# EAGLE board Mainboard (EAGLE 9.0.1), part 1 of 2
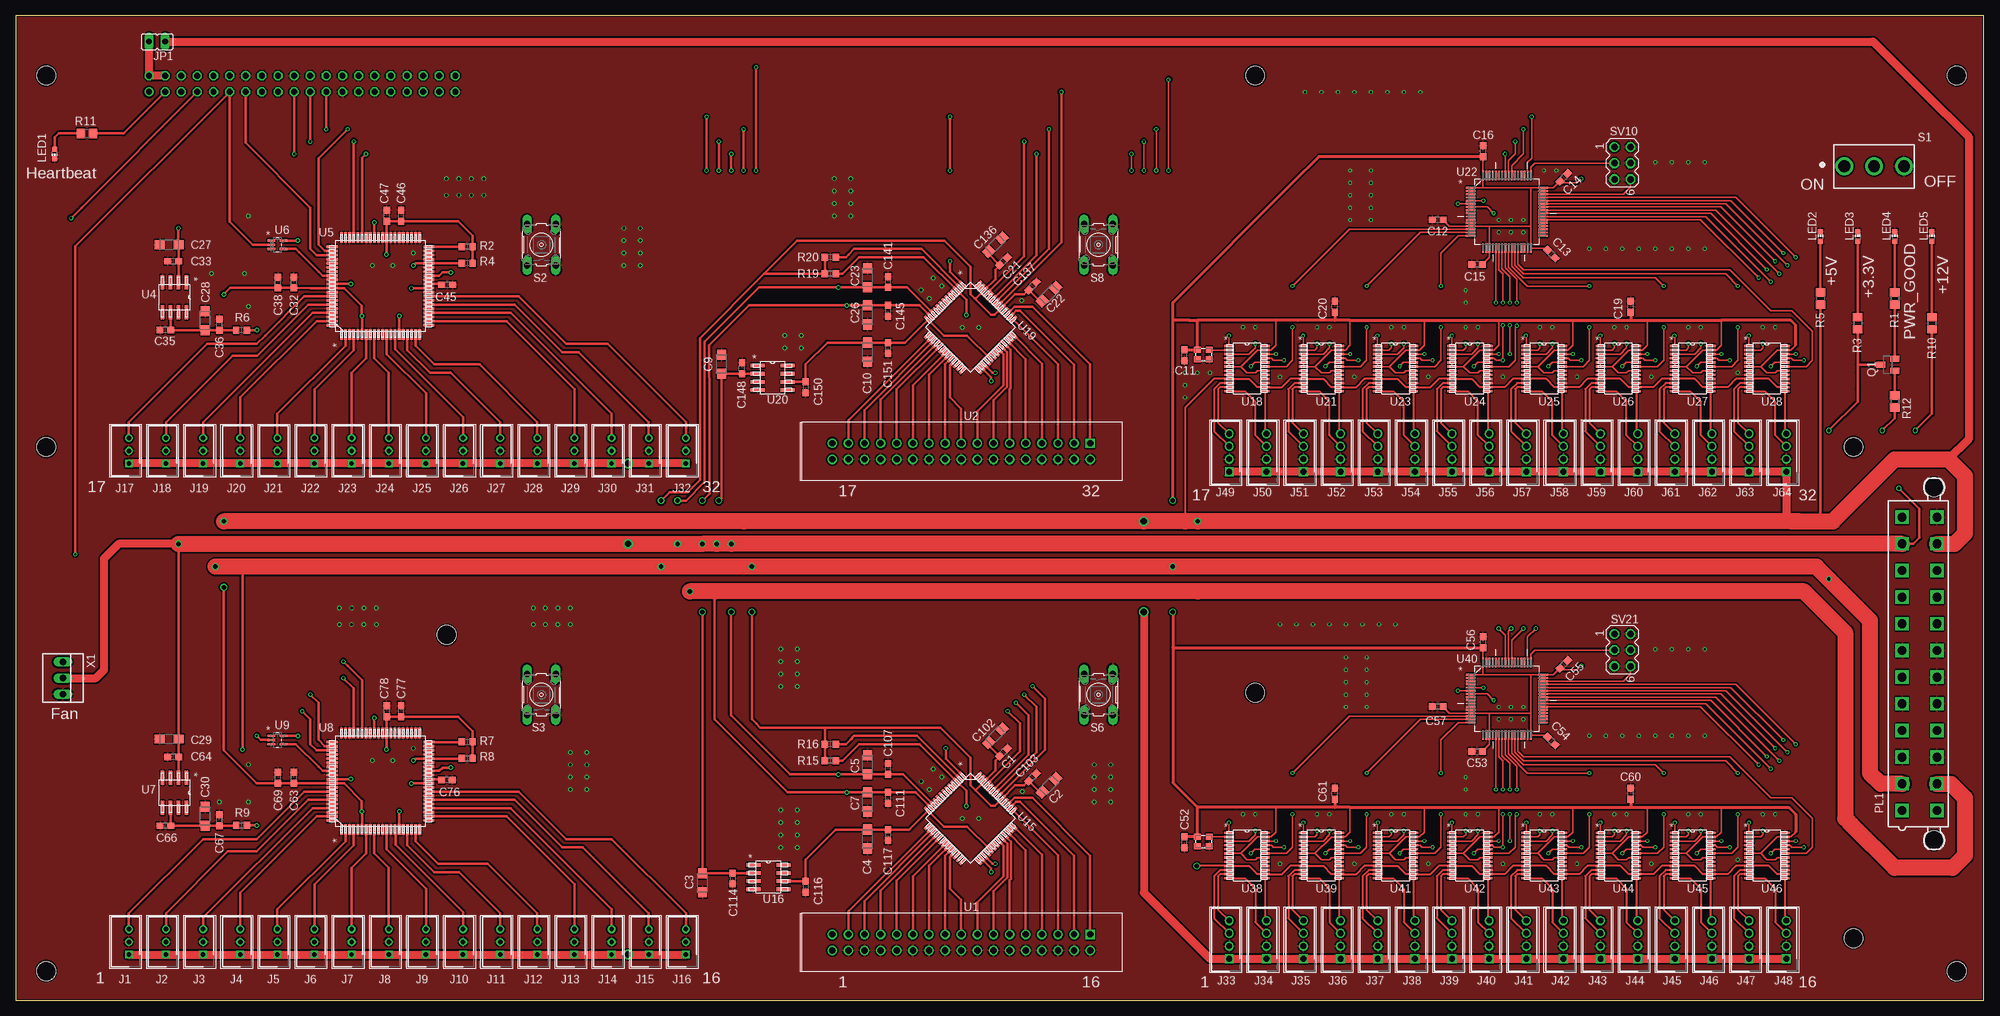
[diagram p11: board, top side]
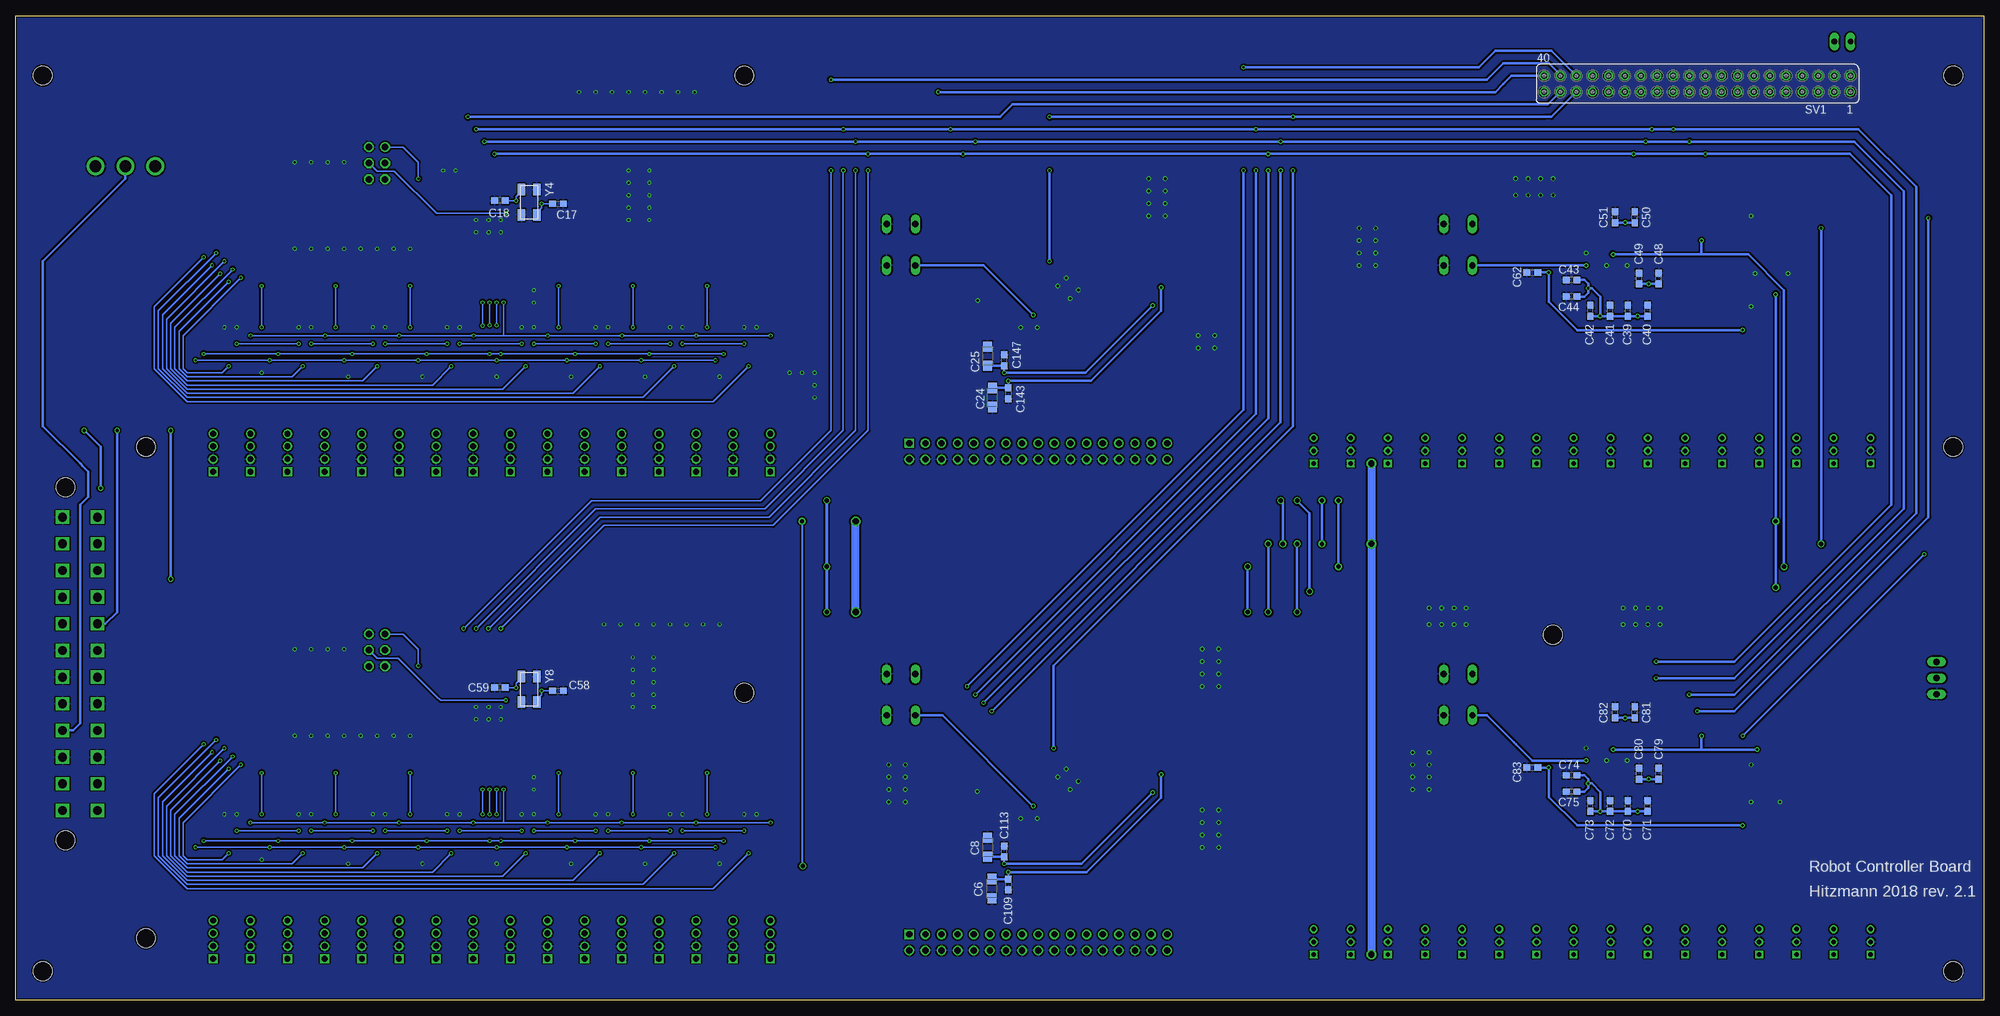
[diagram p12: board, bottom side, seen from below]

Size 310 x 155 mm. Coordinates in mm from the lower left corner, seen from the top.
Outline: 0,0 310,0 310,155 0,155 0,0
Copper layers (1*16): Top 0.035mm / dielectric 1.5mm / Bottom 0.035mm
Design rules "dirt_cheap_dirty_boards.v1.1": minimum track width 6mil, minimum drill 12mil, track to track 6mil, track to pad 6mil, pad to pad 6mil, via to via 6mil, smd to smd 0mil, copper to edge 10mil, drill to drill 10mil, minimum pad ring 10mil, minimum via ring 6mil, stop-mask expansion 2mil, vias tented up to drill 25mil, thermal gap 10mil
Holes 3 mm at 289.5,87.1 289.5,9.75 305.75,145.6 305.75,4.55 4.8,4.55 4.8,145.6 195.25,145.6 4.8,87.1 195.25,48.4 67.85,57.5

## Footprints (pad centres in the part's own frame; a part is rotated, then mirrored left to right if it is on the bottom)
SMC_A = smd 1.6 x 1.4: + -1.5,0; - 1.5,0
C0603 = smd 1.1 x 1: 1 -0.85,0; 2 0.85,0
JST_PH_SHDR3W50P0X200_1X3_790X450X600 = drill 0.7 pad 1.1 square: 1 0,0 | drill 0.7 pad 1.1: 2 2,0; 3 4,0
SHDR4W50P0X200_1X4_990X450X600 = drill 0.9 pad 1.35 square: 1 0,0 | drill 0.9 pad 1.35: 2 2,0; 3 4,0; 4 6,0
JP1 = drill 0.914 long: 1 0,-1.27; 2 0,1.27
CHIP-LED0603 = smd 0.8 x 0.8: A 0,-0.75; C 0,0.75
5566-24 = drill 1.4 square: 1 23.1,-2.75; 2 18.9,-2.75; 3 14.7,-2.75; 4 10.5,-2.75; 5 6.3,-2.75; 6 2.1,-2.75; 7 -2.1,-2.75; 8 -6.3,-2.75; 9 -10.5,-2.75; 10 -14.7,-2.75; 11 -18.9,-2.75; 12 -23.1,-2.75; 13 23.1,2.75; 14 18.9,2.75; 15 14.7,2.75; 16 10.5,2.75; 17 6.3,2.75; 18 2.1,2.75; 19 -2.1,2.75; 20 -6.3,2.75; 21 -10.5,2.75; 22 -14.7,2.75; 23 -18.9,2.75; 24 -23.1,2.75 | hole 3: 27.8,2.29; -27.8,2.29
SOT23-BEC = smd 1 x 1.4: B -0.95,-1.1; C 0,1.1; E 0.95,-1.1
R0805 = smd 1.3 x 1.5: 1 -0.95,0; 2 0.95,0
R0603 = smd 1 x 1.1: 1 -0.85,0; 2 0.85,0
1MS1T1B1M2QES-5 = drill 1.85 pad 2.8: 1 0,-4.7; 2 0,0; 3 0,4.7
B3F-10XX = drill 1.016 long: 1 -3.251,2.261; 2 3.251,2.261; 3 -3.251,-2.261; 4 3.251,-2.261
FE20-2 = drill 0.914: 1 -24.13,1.27 | drill 0.914 octagon: 2 -24.13,-1.27; 3 -21.59,1.27; 4 -21.59,-1.27; 5 -19.05,1.27; 6 -19.05,-1.27; 7 -16.51,1.27; 8 -16.51,-1.27; 9 -13.97,1.27; 10 -13.97,-1.27; 11 -11.43,1.27; 12 -11.43,-1.27; 13 -8.89,1.27; 14 -8.89,-1.27; 15 -6.35,1.27; 16 -6.35,-1.27; 17 -3.81,1.27; 18 -3.81,-1.27; 19 -1.27,1.27; 20 -1.27,-1.27; 21 1.27,1.27; 22 1.27,-1.27; 23 3.81,1.27; 24 3.81,-1.27; 25 6.35,1.27; 26 6.35,-1.27; 27 8.89,1.27; 28 8.89,-1.27; 29 11.43,1.27; 30 11.43,-1.27; 31 13.97,1.27; 32 13.97,-1.27; 33 16.51,1.27; 34 16.51,-1.27; 35 19.05,1.27; 36 19.05,-1.27; 37 21.59,1.27; 38 21.59,-1.27; 39 24.13,1.27; 40 24.13,-1.27
MA03-2 = drill 1.016: 1 -2.54,-1.27 | drill 1.016 octagon: 2 -2.54,1.27; 3 0,-1.27; 4 0,1.27; 5 2.54,-1.27; 6 2.54,1.27
AMP-5103309-7-34PIN_TYCO_5103309-7 = drill 0.965 square: 1 0,2.54 | drill 0.965: 2 0,0; 3 -2.54,2.54; 4 -2.54,0; 5 -5.08,2.54; 6 -5.08,0; 7 -7.62,2.54; 8 -7.62,0; 9 -10.16,2.54; 10 -10.16,0; 11 -12.7,2.54; 12 -12.7,0; 13 -15.24,2.54; 14 -15.24,0; 15 -17.78,2.54; 16 -17.78,0; 17 -20.32,2.54; 18 -20.32,0; 19 -22.86,2.54; 20 -22.86,0; 21 -25.4,2.54; 22 -25.4,0; 23 -27.94,2.54; 24 -27.94,0; 25 -30.48,2.54; 26 -30.48,0; 27 -33.02,2.54; 28 -33.02,0; 29 -35.56,2.54; 30 -35.56,0; 31 -38.1,2.54; 32 -38.1,0; 33 -40.64,2.54; 34 -40.64,0
R_8 = smd 2.184 x 0.559: 1 -2.362,1.905; 2 -2.362,0.635; 3 -2.362,-0.635; 4 -2.362,-1.905; 5 2.362,-1.905; 6 2.362,-0.635; 7 2.362,0.635; 8 2.362,1.905
ST_80_2 = smd 1.676 x 0.432: 1 -7.62,6.175; 2 -7.62,5.525; 3 -7.62,4.875; 4 -7.62,4.225; 5 -7.62,3.575; 6 -7.62,2.925; 7 -7.62,2.275; 8 -7.62,1.625; 9 -7.62,0.975; 10 -7.62,0.325; 11 -7.62,-0.325; 12 -7.62,-0.975; 13 -7.62,-1.625; 14 -7.62,-2.275; 15 -7.62,-2.925; 16 -7.62,-3.575; 17 -7.62,-4.225; 18 -7.62,-4.875; 19 -7.62,-5.525; 20 -7.62,-6.175; 41 7.62,-6.175; 42 7.62,-5.525; 43 7.62,-4.875; 44 7.62,-4.225; 45 7.62,-3.575; 46 7.62,-2.925; 47 7.62,-2.275; 48 7.62,-1.625; 49 7.62,-0.975; 50 7.62,-0.325; 51 7.62,0.325; 52 7.62,0.975; 53 7.62,1.625; 54 7.62,2.275; 55 7.62,2.925; 56 7.62,3.575; 57 7.62,4.225; 58 7.62,4.875; 59 7.62,5.525; 60 7.62,6.175 | smd 0.432 x 1.676: 21 -6.175,-7.62; 22 -5.525,-7.62; 23 -4.875,-7.62; 24 -4.225,-7.62; 25 -3.575,-7.62; 26 -2.925,-7.62; 27 -2.275,-7.62; 28 -1.625,-7.62; 29 -0.975,-7.62; 30 -0.325,-7.62; 31 0.325,-7.62; 32 0.975,-7.62; 33 1.625,-7.62; 34 2.275,-7.62; 35 2.925,-7.62; 36 3.575,-7.62; 37 4.225,-7.62; 38 4.875,-7.62; 39 5.525,-7.62; 40 6.175,-7.62; 61 6.175,7.62; 62 5.525,7.62; 63 4.875,7.62; 64 4.225,7.62; 65 3.575,7.62; 66 2.925,7.62; 67 2.275,7.62; 68 1.625,7.62; 69 0.975,7.62; 70 0.325,7.62; 71 -0.325,7.62; 72 -0.975,7.62; 73 -1.625,7.62; 74 -2.275,7.62; 75 -2.925,7.62; 76 -3.575,7.62; 77 -4.225,7.62; 78 -4.875,7.62; 79 -5.525,7.62; 80 -6.175,7.62
SOT65P210X110-5N = smd 1.168 x 0.356: 1 -0.965,0.66; 2 -0.965,0; 3 -0.965,-0.66; 4 0.965,-0.66; 5 0.965,0.66
ST_52 = smd 1.473 x 0.432: 1 -5.613,3.9; 2 -5.613,3.25; 3 -5.613,2.6; 4 -5.613,1.95; 5 -5.613,1.3; 6 -5.613,0.65; 7 -5.613,0; 8 -5.613,-0.65; 9 -5.613,-1.3; 10 -5.613,-1.95; 11 -5.613,-2.6; 12 -5.613,-3.25; 13 -5.613,-3.9; 27 5.613,-3.9; 28 5.613,-3.25; 29 5.613,-2.6; 30 5.613,-1.95; 31 5.613,-1.3; 32 5.613,-0.65; 33 5.613,0; 34 5.613,0.65; 35 5.613,1.3; 36 5.613,1.95; 37 5.613,2.6; 38 5.613,3.25; 39 5.613,3.9 | smd 0.432 x 1.473: 14 -3.9,-5.613; 15 -3.25,-5.613; 16 -2.6,-5.613; 17 -1.95,-5.613; 18 -1.3,-5.613; 19 -0.65,-5.613; 20 0,-5.613; 21 0.65,-5.613; 22 1.3,-5.613; 23 1.95,-5.613; 24 2.6,-5.613; 25 3.25,-5.613; 26 3.9,-5.613; 40 3.9,5.613; 41 3.25,5.613; 42 2.6,5.613; 43 1.95,5.613; 44 1.3,5.613; 45 0.65,5.613; 46 0,5.613; 47 -0.65,5.613; 48 -1.3,5.613; 49 -1.95,5.613; 50 -2.6,5.613; 51 -3.25,5.613; 52 -3.9,5.613
RU_24 = smd 1.473 x 0.356: 1 -2.819,3.575; 2 -2.819,2.925; 3 -2.819,2.275; 4 -2.819,1.625; 5 -2.819,0.975; 6 -2.819,0.325; 7 -2.819,-0.325; 8 -2.819,-0.975; 9 -2.819,-1.625; 10 -2.819,-2.275; 11 -2.819,-2.925; 12 -2.819,-3.575; 13 2.819,-3.575; 14 2.819,-2.925; 15 2.819,-2.275; 16 2.819,-1.625; 17 2.819,-0.975; 18 2.819,-0.325; 19 2.819,0.325; 20 2.819,0.975; 21 2.819,1.625; 22 2.819,2.275; 23 2.819,2.925; 24 2.819,3.575
QFP50P1200X1200X160-64N = smd 1.473 x 0.279: 1 -5.715,3.759; 2 -5.715,3.251; 3 -5.715,2.743; 4 -5.715,2.261; 5 -5.715,1.753; 6 -5.715,1.245; 7 -5.715,0.762; 8 -5.715,0.254; 9 -5.715,-0.254; 10 -5.715,-0.762; 11 -5.715,-1.245; 12 -5.715,-1.753; 13 -5.715,-2.261; 14 -5.715,-2.743; 15 -5.715,-3.251; 16 -5.715,-3.759; 33 5.715,-3.759; 34 5.715,-3.251; 35 5.715,-2.743; 36 5.715,-2.261; 37 5.715,-1.753; 38 5.715,-1.245; 39 5.715,-0.762; 40 5.715,-0.254; 41 5.715,0.254; 42 5.715,0.762; 43 5.715,1.245; 44 5.715,1.753; 45 5.715,2.261; 46 5.715,2.743; 47 5.715,3.251; 48 5.715,3.759 | smd 0.279 x 1.473: 17 -3.759,-5.715; 18 -3.251,-5.715; 19 -2.743,-5.715; 20 -2.261,-5.715; 21 -1.753,-5.715; 22 -1.245,-5.715; 23 -0.762,-5.715; 24 -0.254,-5.715; 25 0.254,-5.715; 26 0.762,-5.715; 27 1.245,-5.715; 28 1.753,-5.715; 29 2.261,-5.715; 30 2.743,-5.715; 31 3.251,-5.715; 32 3.759,-5.715; 49 3.759,5.715; 50 3.251,5.715; 51 2.743,5.715; 52 2.261,5.715; 53 1.753,5.715; 54 1.245,5.715; 55 0.762,5.715; 56 0.254,5.715; 57 -0.254,5.715; 58 -0.762,5.715; 59 -1.245,5.715; 60 -1.753,5.715; 61 -2.261,5.715; 62 -2.743,5.715; 63 -3.251,5.715; 64 -3.759,5.715
22-23-2031 = drill 1 long: 1 -2.54,0; 2 0,0; 3 2.54,0
KC2520B-C1 = smd 1.05 x 0.95: 1 0,-1.45; 2 1.85,-1.45; 3 1.85,0; 4 0,0
ABM3B = smd 1.8 x 1.2: 1 0,-2.4; 2 4,-2.4; 3 4,0; 4 0,0

## Placement (x,y rotation side)
C1  10uF  [SMC_A]  154.3,41.6 45 top
C2  10uF  [SMC_A]  162.75,33.8 45 top
C3  10uF  [SMC_A]  108.15,18.45 270 top
C4  10uF  [SMC_A]  134.15,25.35 270 top
C5  10uF  [SMC_A]  134.15,37.05 90 top
C6  10uF  [SMC_A]  156.25,17.55 270 bottom
C7  10uF  [SMC_A]  134.15,31.2 90 top
C8  10uF  [SMC_A]  156.9,24.05 270 bottom
C9  10uF  [SMC_A]  111.15,100.15 90 top
C10  10uF  [SMC_A]  134.15,102.05 270 top
C11  100nF  [C0603]  184.1,101.55 90 top
C12  100nF  [C0603]  224,122.9 0 top
C13  100nF  [C0603]  241.9,117.5 315 top
C14  100nF  [C0603]  243.85,129.55 45 top
C15  100nF  [C0603]  230.2,115.85 180 top
C16  100nF  [C0603]  231.15,133.7 90 top
C17  33pf  [C0603]  224.6,125.4 0 bottom
C18  33pf  [C0603]  233.75,125.9 180 bottom
C19  100nF  [C0603]  254.4,109.2 90 top
C20  100nF  [C0603]  207.8,109.2 90 top
C21  10uF  [SMC_A]  154.3,118.95 45 top
C22  10uF  [SMC_A]  162.75,111.15 45 top
C23  10uF  [SMC_A]  134.15,113.75 90 top
C24  10uF  [SMC_A]  156.15,94.9 270 bottom
C25  10uF  [SMC_A]  156.9,101.4 270 bottom
C26  10uF  [SMC_A]  134.15,107.9 90 top
C27  10uF  [SMC_A]  24.15,118.95 180 top
C28  10uF  [SMC_A]  29.8,107 90 top
C29  10uF  [SMC_A]  24.15,41.1 180 top
C30  10uF  [SMC_A]  29.8,28.95 90 top
C32  100nF  [C0603]  43.8,113 90 top
C33  100nF  [C0603]  24.8,116.35 180 top
C35  100nF  [C0603]  23.55,105.5 180 top
C36  100nF  [C0603]  32.05,106.35 90 top
C38  10uF  [C0603]  41.3,113 90 top
C39  100nF  [C0603]  56.05,108.55 90 bottom
C40  10uF  [C0603]  52.95,108.55 90 bottom
C41  100nF  [C0603]  58.85,108.55 90 bottom
C42  10uF  [C0603]  61.95,108.55 90 bottom
C43  100nF  [C0603]  64.9,113.4 180 bottom
C44  10uF  [C0603]  64.9,110.8 180 bottom
C45  10uF  [C0603]  67.95,112.65 180 top
C46  100nF  [C0603]  60.7,123.5 90 top
C47  10uF  [C0603]  58.45,123.5 90 top
C48  100nF  [C0603]  51.2,113.65 90 bottom
C49  10uF  [C0603]  54.3,113.65 90 bottom
C50  10uF  [C0603]  54.95,123.3 90 bottom
C51  100nF  [C0603]  58.05,123.3 90 bottom
C52  100nF  [C0603]  184.1,24.85 90 top
C53  100nF  [C0603]  230.2,39.15 0 top
C54  100nF  [C0603]  241.9,40.8 315 top
C55  100nF  [C0603]  243.85,52.85 45 top
C56  100nF  [C0603]  231.15,56.35 90 top
C57  100nF  [C0603]  224,46.2 180 top
C58  33pf  [C0603]  224.6,48.7 0 bottom
C59  33pf  [C0603]  233.75,49.2 180 bottom
C60  100nF  [C0603]  254.4,32.5 90 top
C61  100nF  [C0603]  207.8,32.5 90 top
C62  100nF  [C0603]  71.1,114.6 0 bottom
C63  100nF  [C0603]  43.8,35 90 top
C64  100nF  [C0603]  24.8,38.3 180 top
C66  100nF  [C0603]  23.55,27.45 180 top
C67  100nF  [C0603]  32.05,28.3 90 top
C69  10uF  [C0603]  41.3,35 90 top
C70  100nF  [C0603]  56.05,30.55 90 bottom
C71  10uF  [C0603]  52.95,30.55 90 bottom
C72  100nF  [C0603]  58.85,30.55 90 bottom
C73  10uF  [C0603]  61.95,30.55 90 bottom
C74  100nF  [C0603]  64.9,35.4 180 bottom
C75  10uF  [C0603]  64.9,32.8 180 bottom
C76  10uF  [C0603]  67.9,34.65 180 top
C77  100nF  [C0603]  60.7,45.5 90 top
C78  10uF  [C0603]  58.45,45.5 90 top
C79  100nF  [C0603]  51.2,35.65 90 bottom
C80  10uF  [C0603]  54.3,35.65 90 bottom
C81  10uF  [C0603]  54.95,45.3 90 bottom
C82  100nF  [C0603]  58.05,45.3 90 bottom
C83  100nF  [C0603]  71.1,36.6 0 bottom
C102  100nF  [C0603]  155.6,39 45 top
C103  100nF  [C0603]  160.15,35.1 45 top
C107  100nF  [C0603]  137.4,36.4 90 top
C109  100nF  [C0603]  153.65,18.2 270 bottom
C111  100nF  [C0603]  137.4,31.85 270 top
C113  100nF  [C0603]  154.3,23.4 90 bottom
C114  100nF  [C0603]  112.9,19.15 270 top
C116  100nF  [C0603]  124.4,17.85 270 top
C117  100nF  [C0603]  137.4,26 270 top
C136  100nF  [C0603]  155.6,116.35 45 top
C137  100nF  [C0603]  160.15,112.45 45 top
C141  100nF  [C0603]  137.4,113.1 90 top
C143  100nF  [C0603]  153.65,95.55 270 bottom
C145  100nF  [C0603]  137.4,108.55 270 top
C147  100nF  [C0603]  154.3,100.75 90 bottom
C148  100nF  [C0603]  114.4,99.5 90 top
C150  100nF  [C0603]  124.4,96.5 270 top
C151  100nF  [C0603]  137.4,102.7 270 top
J1  JST_PH_B3B-PH-K-S(LF)(SN)  [JST_PH_SHDR3W50P0X200_1X3_790X450X600]  17.8,7.15 90 top
J2  JST_PH_B3B-PH-K-S(LF)(SN)  [JST_PH_SHDR3W50P0X200_1X3_790X450X600]  23.65,7.15 90 top
J3  JST_PH_B3B-PH-K-S(LF)(SN)  [JST_PH_SHDR3W50P0X200_1X3_790X450X600]  29.5,7.15 90 top
J4  JST_PH_B3B-PH-K-S(LF)(SN)  [JST_PH_SHDR3W50P0X200_1X3_790X450X600]  35.35,7.15 90 top
J5  JST_PH_B3B-PH-K-S(LF)(SN)  [JST_PH_SHDR3W50P0X200_1X3_790X450X600]  41.2,7.15 90 top
J6  JST_PH_B3B-PH-K-S(LF)(SN)  [JST_PH_SHDR3W50P0X200_1X3_790X450X600]  47.05,7.15 90 top
J7  JST_PH_B3B-PH-K-S(LF)(SN)  [JST_PH_SHDR3W50P0X200_1X3_790X450X600]  52.9,7.15 90 top
J8  JST_PH_B3B-PH-K-S(LF)(SN)  [JST_PH_SHDR3W50P0X200_1X3_790X450X600]  58.75,7.15 90 top
J9  JST_PH_B3B-PH-K-S(LF)(SN)  [JST_PH_SHDR3W50P0X200_1X3_790X450X600]  64.6,7.15 90 top
J10  JST_PH_B3B-PH-K-S(LF)(SN)  [JST_PH_SHDR3W50P0X200_1X3_790X450X600]  70.45,7.15 90 top
J11  JST_PH_B3B-PH-K-S(LF)(SN)  [JST_PH_SHDR3W50P0X200_1X3_790X450X600]  76.3,7.15 90 top
J12  JST_PH_B3B-PH-K-S(LF)(SN)  [JST_PH_SHDR3W50P0X200_1X3_790X450X600]  82.15,7.15 90 top
J13  JST_PH_B3B-PH-K-S(LF)(SN)  [JST_PH_SHDR3W50P0X200_1X3_790X450X600]  88,7.15 90 top
J14  JST_PH_B3B-PH-K-S(LF)(SN)  [JST_PH_SHDR3W50P0X200_1X3_790X450X600]  93.85,7.15 90 top
J15  JST_PH_B3B-PH-K-S(LF)(SN)  [JST_PH_SHDR3W50P0X200_1X3_790X450X600]  99.7,7.15 90 top
J16  JST_PH_B3B-PH-K-S(LF)(SN)  [JST_PH_SHDR3W50P0X200_1X3_790X450X600]  105.55,7.15 90 top
J17  JST_PH_B3B-PH-K-S(LF)(SN)  [JST_PH_SHDR3W50P0X200_1X3_790X450X600]  17.8,84.5 90 top
J18  JST_PH_B3B-PH-K-S(LF)(SN)  [JST_PH_SHDR3W50P0X200_1X3_790X450X600]  23.65,84.5 90 top
J19  JST_PH_B3B-PH-K-S(LF)(SN)  [JST_PH_SHDR3W50P0X200_1X3_790X450X600]  29.5,84.5 90 top
J20  JST_PH_B3B-PH-K-S(LF)(SN)  [JST_PH_SHDR3W50P0X200_1X3_790X450X600]  35.35,84.5 90 top
J21  JST_PH_B3B-PH-K-S(LF)(SN)  [JST_PH_SHDR3W50P0X200_1X3_790X450X600]  41.2,84.5 90 top
J22  JST_PH_B3B-PH-K-S(LF)(SN)  [JST_PH_SHDR3W50P0X200_1X3_790X450X600]  47.05,84.5 90 top
J23  JST_PH_B3B-PH-K-S(LF)(SN)  [JST_PH_SHDR3W50P0X200_1X3_790X450X600]  52.9,84.5 90 top
J24  JST_PH_B3B-PH-K-S(LF)(SN)  [JST_PH_SHDR3W50P0X200_1X3_790X450X600]  58.75,84.5 90 top
J25  JST_PH_B3B-PH-K-S(LF)(SN)  [JST_PH_SHDR3W50P0X200_1X3_790X450X600]  64.6,84.5 90 top
J26  JST_PH_B3B-PH-K-S(LF)(SN)  [JST_PH_SHDR3W50P0X200_1X3_790X450X600]  70.45,84.5 90 top
J27  JST_PH_B3B-PH-K-S(LF)(SN)  [JST_PH_SHDR3W50P0X200_1X3_790X450X600]  76.3,84.5 90 top
J28  JST_PH_B3B-PH-K-S(LF)(SN)  [JST_PH_SHDR3W50P0X200_1X3_790X450X600]  82.15,84.5 90 top
J29  JST_PH_B3B-PH-K-S(LF)(SN)  [JST_PH_SHDR3W50P0X200_1X3_790X450X600]  88,84.5 90 top
J30  JST_PH_B3B-PH-K-S(LF)(SN)  [JST_PH_SHDR3W50P0X200_1X3_790X450X600]  93.85,84.5 90 top
J31  JST_PH_B3B-PH-K-S(LF)(SN)  [JST_PH_SHDR3W50P0X200_1X3_790X450X600]  99.7,84.5 90 top
J32  JST_PH_B3B-PH-K-S(LF)(SN)  [JST_PH_SHDR3W50P0X200_1X3_790X450X600]  105.55,84.5 90 top
J33  [SHDR4W50P0X200_1X4_990X450X600]  191.15,6.5 90 top
J34  [SHDR4W50P0X200_1X4_990X450X600]  197,6.5 90 top
J35  [SHDR4W50P0X200_1X4_990X450X600]  202.85,6.5 90 top
J36  [SHDR4W50P0X200_1X4_990X450X600]  208.7,6.5 90 top
J37  [SHDR4W50P0X200_1X4_990X450X600]  214.55,6.5 90 top
J38  [SHDR4W50P0X200_1X4_990X450X600]  220.4,6.5 90 top
J39  [SHDR4W50P0X200_1X4_990X450X600]  226.25,6.5 90 top
J40  [SHDR4W50P0X200_1X4_990X450X600]  232.1,6.5 90 top
J41  [SHDR4W50P0X200_1X4_990X450X600]  237.95,6.5 90 top
J42  [SHDR4W50P0X200_1X4_990X450X600]  243.8,6.5 90 top
J43  [SHDR4W50P0X200_1X4_990X450X600]  249.65,6.5 90 top
J44  [SHDR4W50P0X200_1X4_990X450X600]  255.5,6.5 90 top
J45  [SHDR4W50P0X200_1X4_990X450X600]  261.35,6.5 90 top
J46  [SHDR4W50P0X200_1X4_990X450X600]  267.2,6.5 90 top
J47  [SHDR4W50P0X200_1X4_990X450X600]  273.05,6.5 90 top
J48  [SHDR4W50P0X200_1X4_990X450X600]  278.9,6.5 90 top
J49  [SHDR4W50P0X200_1X4_990X450X600]  191.15,83.2 90 top
J50  [SHDR4W50P0X200_1X4_990X450X600]  197,83.2 90 top
J51  [SHDR4W50P0X200_1X4_990X450X600]  202.85,83.2 90 top
J52  [SHDR4W50P0X200_1X4_990X450X600]  208.7,83.2 90 top
J53  [SHDR4W50P0X200_1X4_990X450X600]  214.55,83.2 90 top
J54  [SHDR4W50P0X200_1X4_990X450X600]  220.4,83.2 90 top
J55  [SHDR4W50P0X200_1X4_990X450X600]  226.25,83.2 90 top
J56  [SHDR4W50P0X200_1X4_990X450X600]  232.1,83.2 90 top
J57  [SHDR4W50P0X200_1X4_990X450X600]  237.95,83.2 90 top
J58  [SHDR4W50P0X200_1X4_990X450X600]  243.8,83.2 90 top
J59  [SHDR4W50P0X200_1X4_990X450X600]  249.65,83.2 90 top
J60  [SHDR4W50P0X200_1X4_990X450X600]  255.5,83.2 90 top
J61  [SHDR4W50P0X200_1X4_990X450X600]  261.35,83.2 90 top
J62  [SHDR4W50P0X200_1X4_990X450X600]  267.2,83.2 90 top
J63  [SHDR4W50P0X200_1X4_990X450X600]  273.05,83.2 90 top
J64  [SHDR4W50P0X200_1X4_990X450X600]  278.9,83.2 90 top
JP1  [JP1]  22.25,150.95 90 top
LED1  [CHIP-LED0603]  6.1,133.25 180 top
LED2  [CHIP-LED0603]  284.3,120.25 0 top
LED3  [CHIP-LED0603]  290.15,120.25 0 top
LED4  [CHIP-LED0603]  296,120.25 0 top
LED5  [CHIP-LED0603]  301.85,120.25 0 top
PL1  [5566-24]  299.9,52.95 270 top
Q1  [SOT23-BEC]  294.9,100.05 90 top
R1  68  [R0805]  296,110.5 270 top
R2  10k  [R0603]  71.1,118.65 0 top
R3  68  [R0805]  290.15,106.6 270 top
R4  10k  [R0603]  71.1,116.05 0 top
R5  220  [R0805]  284.3,110.5 270 top
R6  10k  [R0603]  35.55,105.5 180 top
R7  10k  [R0603]  71.1,40.65 0 top
R8  10k  [R0603]  71.1,38.05 0 top
R9  10k  [R0603]  35.55,27.5 180 top
R10  680  [R0805]  301.85,106.6 270 top
R11  330  [R0805]  11.2,136.5 0 top
R12  1k  [R0805]  296,94.25 270 top
R15  100k  [R0603]  128.3,37.7 0 top
R16  100k  [R0603]  128.3,40.3 0 top
R19  100k  [R0603]  128.3,114.4 0 top
R20  100k  [R0603]  128.3,117 0 top
S1  [1MS1T1B1M2QES-5]  292.75,131.3 270 top
S2  [B3F-10XX]  82.8,118.95 90 top
S3  [B3F-10XX]  82.8,48.1 90 top
S6  [B3F-10XX]  170.55,48.1 270 top
S8  [B3F-10XX]  170.55,118.95 270 top
SV1  [FE20-2]  45.1,144.3 180 bottom
SV10  [MA03-2]  253.1,131.8 270 top
SV21  [MA03-2]  253.1,55.1 270 top
U1  [AMP-5103309-7-34PIN_TYCO_5103309-7]  169.25,7.8 0 top
U2  [AMP-5103309-7-34PIN_TYCO_5103309-7]  169.25,85.15 0 top
U4  ADR421ARZ  [R_8]  25,110.7 270 top
U5  AD7616BSTZ  [ST_80_2]  57.45,112.45 90 top
U6  74AHC1G04GW/T1  [SOT65P210X110-5N]  41.2,118.95 0 top
U7  ADR421ARZ  [R_8]  25,32.65 270 top
U8  AD7616BSTZ  [ST_80_2]  57.45,34.45 90 top
U9  74AHC1G04GW/T1  [SOT65P210X110-5N]  41.2,40.95 0 top
U15  AD5360BSTZ  [ST_52]  150.4,28.6 315 top
U16  ADR425ARZ  [R_8]  118.55,19.35 0 top
U18  AD7730BRUZ  [RU_24]  193.95,99.45 0 top
U19  AD5360BSTZ  [ST_52]  150.4,105.95 315 top
U20  ADR425ARZ  [R_8]  119.2,98 0 top
U21  AD7730BRUZ  [RU_24]  205.65,99.45 0 top
U22  STM32F103RCT6  [QFP50P1200X1200X160-64N]  234.9,124.15 0 top
U23  AD7730BRUZ  [RU_24]  217.35,99.45 0 top
U24  AD7730BRUZ  [RU_24]  229.05,99.45 0 top
U25  AD7730BRUZ  [RU_24]  240.75,99.45 0 top
U26  AD7730BRUZ  [RU_24]  252.45,99.45 0 top
U27  AD7730BRUZ  [RU_24]  264.15,99.45 0 top
U28  AD7730BRUZ  [RU_24]  275.85,99.45 0 top
U38  AD7730BRUZ  [RU_24]  193.95,22.75 0 top
U39  AD7730BRUZ  [RU_24]  205.65,22.75 0 top
U40  STM32F103RCT6  [QFP50P1200X1200X160-64N]  234.9,47.45 0 top
U41  AD7730BRUZ  [RU_24]  217.35,22.75 0 top
U42  AD7730BRUZ  [RU_24]  229.05,22.75 0 top
U43  AD7730BRUZ  [RU_24]  240.75,22.75 0 top
U44  AD7730BRUZ  [RU_24]  252.45,22.75 0 top
U45  AD7730BRUZ  [RU_24]  264.15,22.75 0 top
U46  AD7730BRUZ  [RU_24]  275.85,22.75 0 top
X1  22-23-2031  [22-23-2031]  7.4,50.7 270 top
Y3  KC2520B-C1  [KC2520B-C1]  186.15,102.4 0 top
Y4  ABM3B  [ABM3B]  227.95,127.65 270 bottom
Y7  KC2520B-C1  [KC2520B-C1]  186.15,25.7 0 top
Y8  ABM3B  [ABM3B]  227.95,50.95 270 bottom